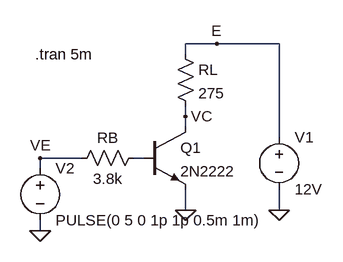
[diagram p0: schematic sch1.asc]
sch1.asc, the LTspice schematic file:
Version 4
SHEET 1 880 680
WIRE 288 128 240 128
WIRE 384 128 288 128
WIRE 240 144 240 128
WIRE 240 240 240 224
WIRE 240 256 240 240
WIRE 384 272 384 128
WIRE 80 304 16 304
WIRE 176 304 160 304
WIRE 16 320 16 304
WIRE 240 384 240 352
WIRE 384 384 384 352
WIRE 16 416 16 400
FLAG 240 384 0
FLAG 384 384 0
FLAG 16 416 0
FLAG 288 128 E
FLAG 16 304 VE
FLAG 240 240 VC
SYMBOL npn 176 256 R0
SYMATTR InstName Q1
SYMATTR Value 2N2222
SYMBOL voltage 384 256 R0
WINDOW 123 0 0 Left 0
WINDOW 39 0 0 Left 0
SYMATTR InstName V1
SYMATTR Value 12V
SYMBOL res 224 128 R0
SYMATTR InstName RL
SYMATTR Value 275
SYMBOL res 176 288 R90
WINDOW 0 0 56 VBottom 0
WINDOW 3 32 56 VTop 0
SYMATTR InstName RB
SYMATTR Value 3.8k
SYMBOL voltage 16 304 R0
WINDOW 123 0 0 Left 0
WINDOW 39 0 0 Left 0
SYMATTR InstName V2
SYMATTR Value PULSE(0 5 0 1p 1p 0.5m 1m)
TEXT 8 144 Left 0 !.tran 5m

The netlist it stands for:
* sch1.asc
Q1 VC N001 0 0 2N2222
V1 E 0 12V
RL E VC 275
RB N001 VE 3.8k
V2 VE 0 PULSE(0 5 0 1p 1p 0.5m 1m)
.model NPN NPN
.model PNP PNP
.lib standard.bjt
.tran 5m
.backanno
.end